# Altium schematic sheet E180-ZG120B-TB-SCH.SchDoc
size A3
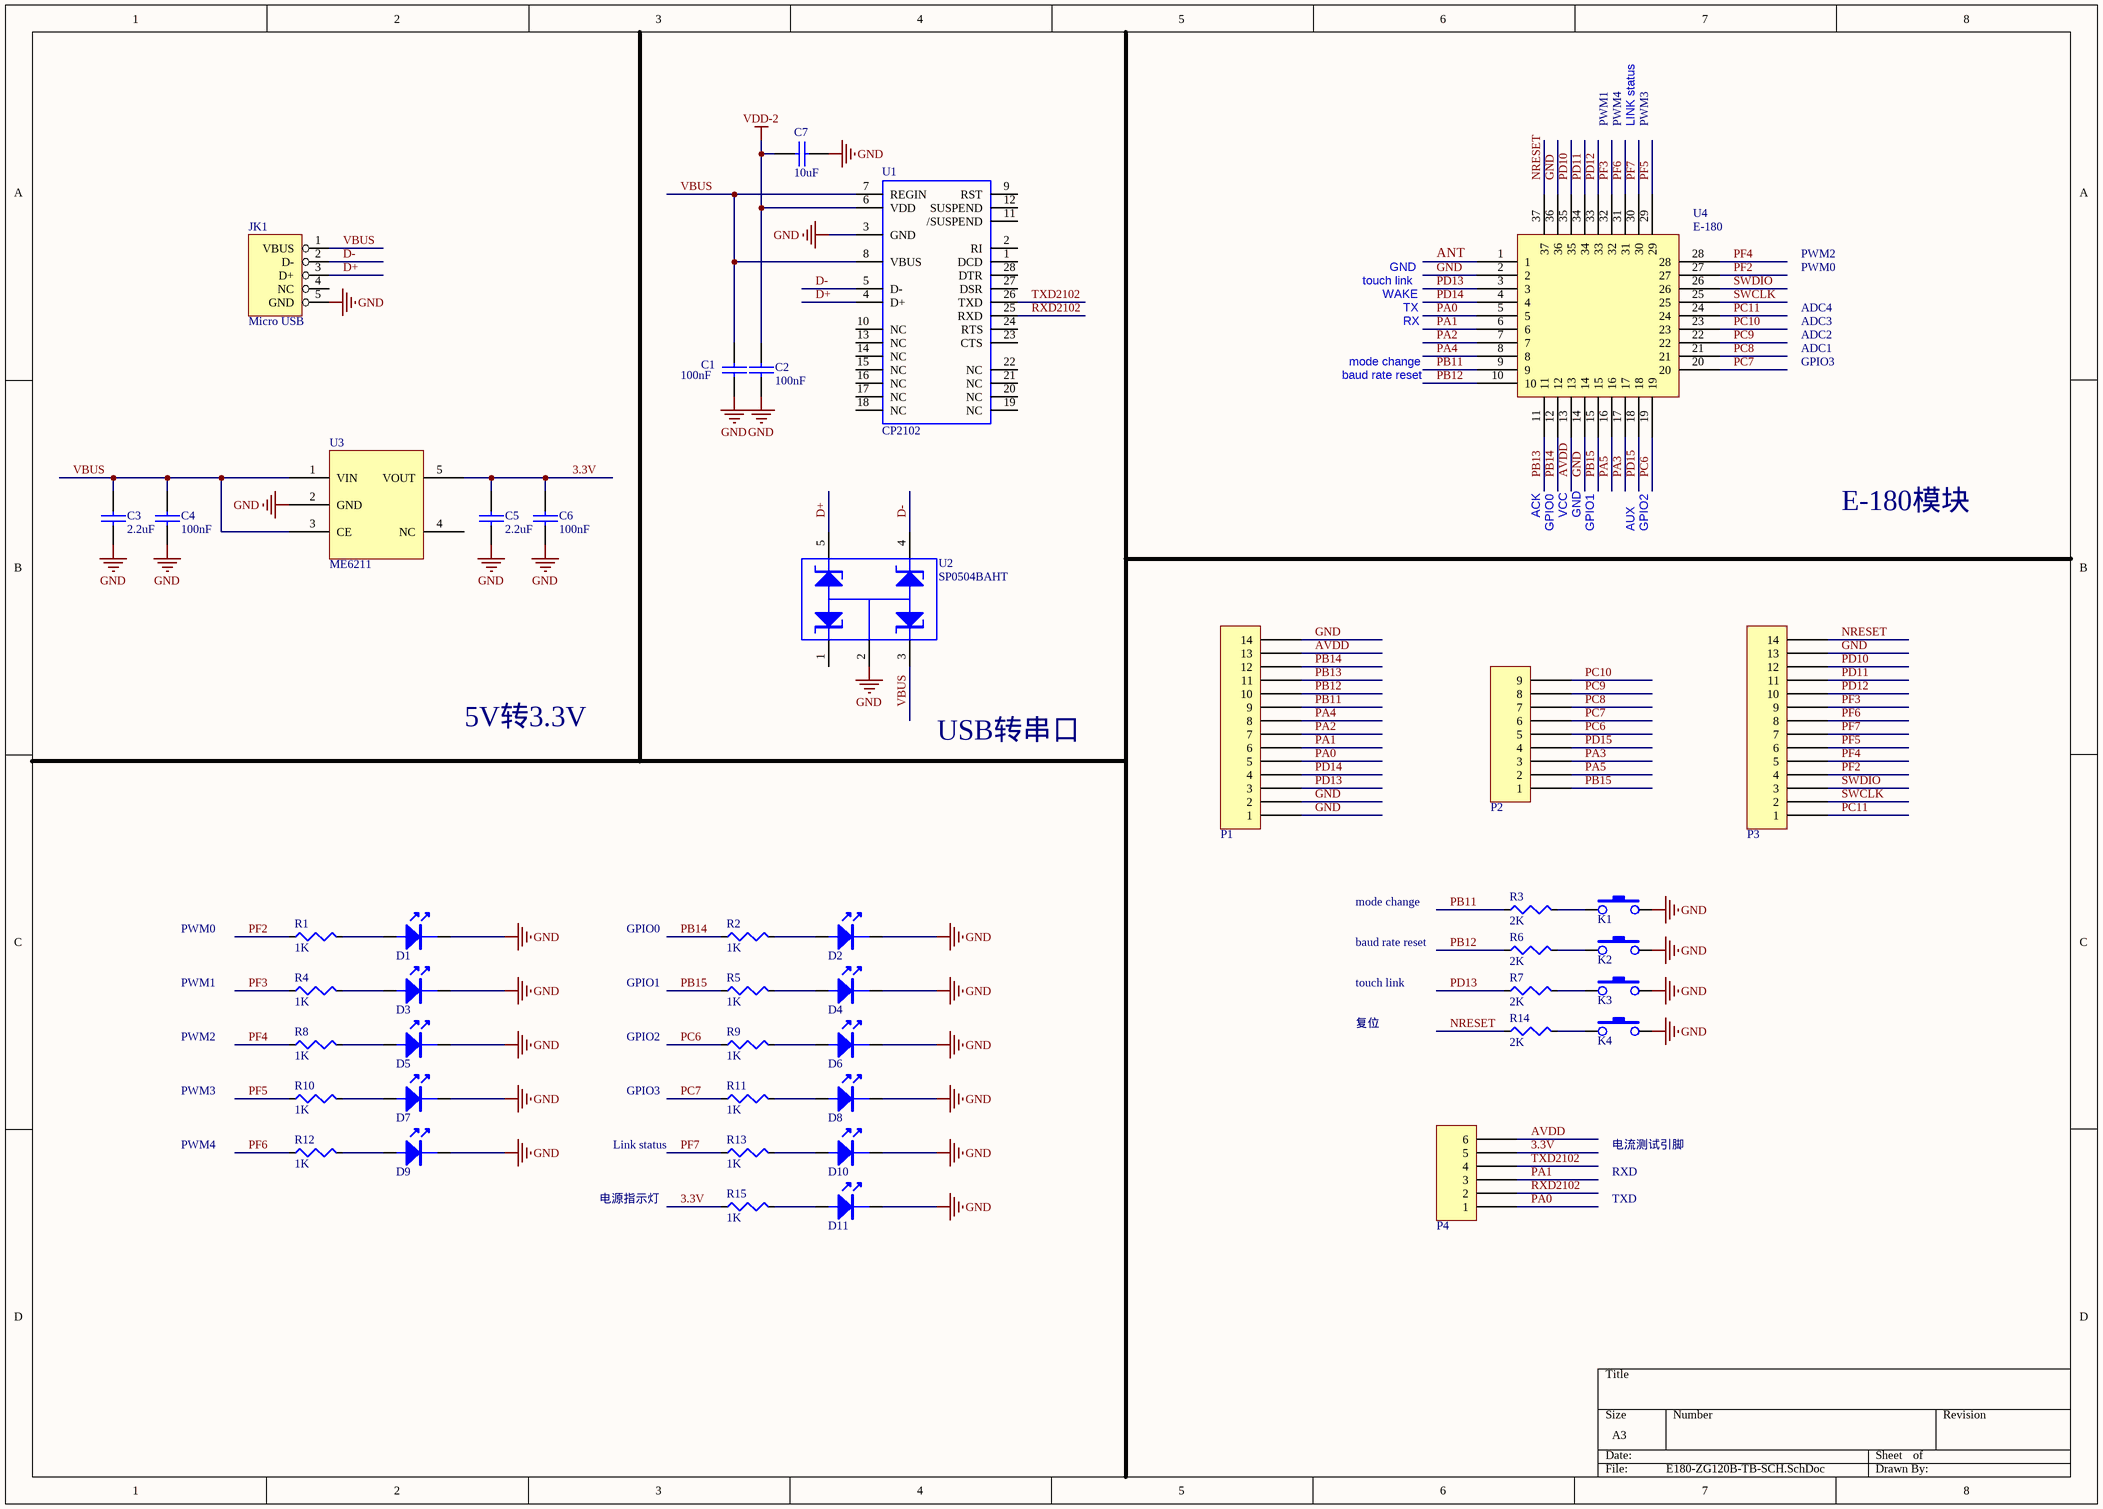
[diagram p0: E180-ZG120B-TB-SCH.SchDoc]

## Parts
C1  100nF  [E-CAP-0603]
C2  100nF  [E-CAP-0603]
C3  2.2uF  [E-CAP-0603]
C4  100nF  [E-CAP-0603]
C5  2.2uF  [E-CAP-0603]
C6  100nF  [E-CAP-0603]
C7  10uF  [E-CAP-0603]
D1  LED  [E-LED-0603]  (value not drawn)
D2  LED  [E-LED-0603]  (value not drawn)
D3  LED  [E-LED-0603]  (value not drawn)
D4  LED  [E-LED-0603]  (value not drawn)
D5  LED  [E-LED-0603]  (value not drawn)
D6  LED  [E-LED-0603]  (value not drawn)
D7  LED  [E-LED-0603]  (value not drawn)
D8  LED  [E-LED-0603]  (value not drawn)
D9  LED  [E-LED-0603]  (value not drawn)
D10  LED  [E-LED-0603]  (value not drawn)
D11  LED  [E-LED-0603]  (value not drawn)
JK1  Micro USB  [E-Micro USB-5SB]
K1  KEY0  [KEY]  (value not drawn)
K2  KEY0  [KEY]  (value not drawn)
K3  KEY0  [KEY]  (value not drawn)
K4  KEY0  [KEY]  (value not drawn)
P1  Header1*14  [E-2X7P-2.54-1]  (value not drawn)
P2  Header1*9  [E-9P-2.54-1]  (value not drawn)
P3  Header1*14  [E-2X7P-2.54-1]  (value not drawn)
P4  Header1*6  [E-6P-2.54-1]  (value not drawn)
R1  1K  [E-RES-0603]
R2  1K  [E-RES-0603]
R3  2K  [E-RES-0603]
R4  1K  [E-RES-0603]
R5  1K  [E-RES-0603]
R6  2K  [E-RES-0603]
R7  2K  [E-RES-0603]
R8  1K  [E-RES-0603]
R9  1K  [E-RES-0603]
R10  1K  [E-RES-0603]
R11  1K  [E-RES-0603]
R12  1K  [E-RES-0603]
R13  1K  [E-RES-0603]
R14  2K  [E-RES-0603]
R15  1K  [E-RES-0603]
U1  CP2102  [E-QFN28-5X5-P0.5]
U2  SP0504BAHT  [SP0504]
U3  ME6211  [E-SOT23-5]
U4  E-180  [E-180]

## Nets
GND: C1.2 C2.2 C3.2 C4.2 C5.2 C6.2 C7.2 D1.K D2.K D3.K D4.K D5.K D6.K D7.K D8.K D9.K D10.K D11.K JK1.5(GND) K1.2 K2.2 K3.2 K4.2 P1.1 P1.2 P1.14 P3.13 U1.3(GND) U2.2 U3.2(GND) U4.2 U4.14 U4.36
VDD-2: C2.1 C7.1 U1.6(VDD)
3.3V: C5.1 C6.1 P4.5 R15.1 U3.5(VOUT)
ANT: U4.1
AVDD: P1.13 P4.6 U4.13
D+: JK1.3(D+) U1.4(D+) U2.5
D-: JK1.2(D-) U1.5(D-) U2.4
NRESET: P3.14 R14.1 U4.37
PA0: P1.5 P4.1 U4.5
PA1: P1.6 P4.3 U4.6
PA2: P1.7 U4.7
PA3: P2.3 U4.17
PA4: P1.8 U4.8
PA5: P2.2 U4.16
PB11: P1.9 R3.1 U4.9
PB12: P1.10 R6.1 U4.10
PB13: P1.11 U4.11
PB14: P1.12 R2.1 U4.12
PB15: P2.1 R5.1 U4.15
PC6: P2.5 R9.1 U4.19
PC7: P2.6 R11.1 U4.20
PC8: P2.7 U4.21
PC9: P2.8 U4.22
PC10: P2.9 U4.23
PC11: P3.1 U4.24
PD10: P3.12 U4.35
PD11: P3.11 U4.34
PD12: P3.10 U4.33
PD13: P1.3 R7.1 U4.3
PD14: P1.4 U4.4
PD15: P2.4 U4.18
PF2: P3.4 R1.1 U4.27
PF3: P3.9 R4.1 U4.32
PF4: P3.5 R8.1 U4.28
PF5: P3.6 R10.1 U4.29
PF6: P3.8 R12.1 U4.31
PF7: P3.7 R13.1 U4.30
RXD2102: P4.2 U1.25(RXD)
SWCLK: P3.2 U4.25
SWDIO: P3.3 U4.26
TXD2102: P4.4 U1.26(TXD)
VBUS: C1.1 C3.1 C4.1 JK1.1(VBUS) U1.7(REGIN) U1.8(VBUS) U2.3 U3.1(VIN) U3.3(CE)
NetD1_A: D1.A R1.2
NetD2_A: D2.A R2.2
NetD3_A: D3.A R4.2
NetD4_A: D4.A R5.2
NetD5_A: D5.A R8.2
NetD6_A: D6.A R9.2
NetD7_A: D7.A R10.2
NetD8_A: D8.A R11.2
NetD9_A: D9.A R12.2
NetD10_A: D10.A R13.2
NetD11_A: D11.A R15.2
NetK1_1: K1.1 R3.2
NetK2_1: K2.1 R6.2
NetK3_1: K3.1 R7.2
NetK4_1: K4.1 R14.2

Not connected (* = marked no-connect by the designer): JK1 4(NC); U1 1(DCD) 2(RI) 9(RST) 10(NC) 11(/SUSPEND) 12(SUSPEND) 13(NC) 14(NC) 15(NC) 16(NC) 17(NC) 18(NC) 19(NC) 20(NC) 21(NC) 22(NC) 23(CTS) 24(RTS) 27(DSR) 28(DTR); U2 1; U3 4(NC)

## Notes on the sheet
- PWM1
- PWM4
- PWM3
- ADC4
- PWM0
- PWM2
- GPIO3
- ADC1
- ADC2
- ADC3
- E-180模块
- 5V转3.3V
- USB转串口
- mode change
- GPIO0
- GPIO1
- baud rate reset
- touch link
- GPIO2
- 复位
- Link status
- 电流测试引脚
- RXD
- 电源指示灯
- TXD
- Labels drawn without touching a wire or pin: ACK, AUX, baud rate reset, GND, GPIO0, GPIO1, GPIO2, LINK status, mode change, RX, touch link, TX, VCC, WAKE

## Library data of the parts
C1-C7 = CAP 0603: Capacitor
R1-R15 = RES 0603
U2 = SP0504
U3 = HT7233